# EasyEDA Pro project RCkid.epro, schematic Cartridge
Board Name: Cartridge; Create Date: 2025-02-21; Page Name: Cartridge 1; Project Name: rckid3_devboard; Schematic Name: Cartridge; Update Date: 2025-02-21; Company: EasyEDA.com; Drawn: EasyEDA; Page Size: A4; Part Number: JLCPCB-002; Reviewed: EasyEDA; Version: V0.1
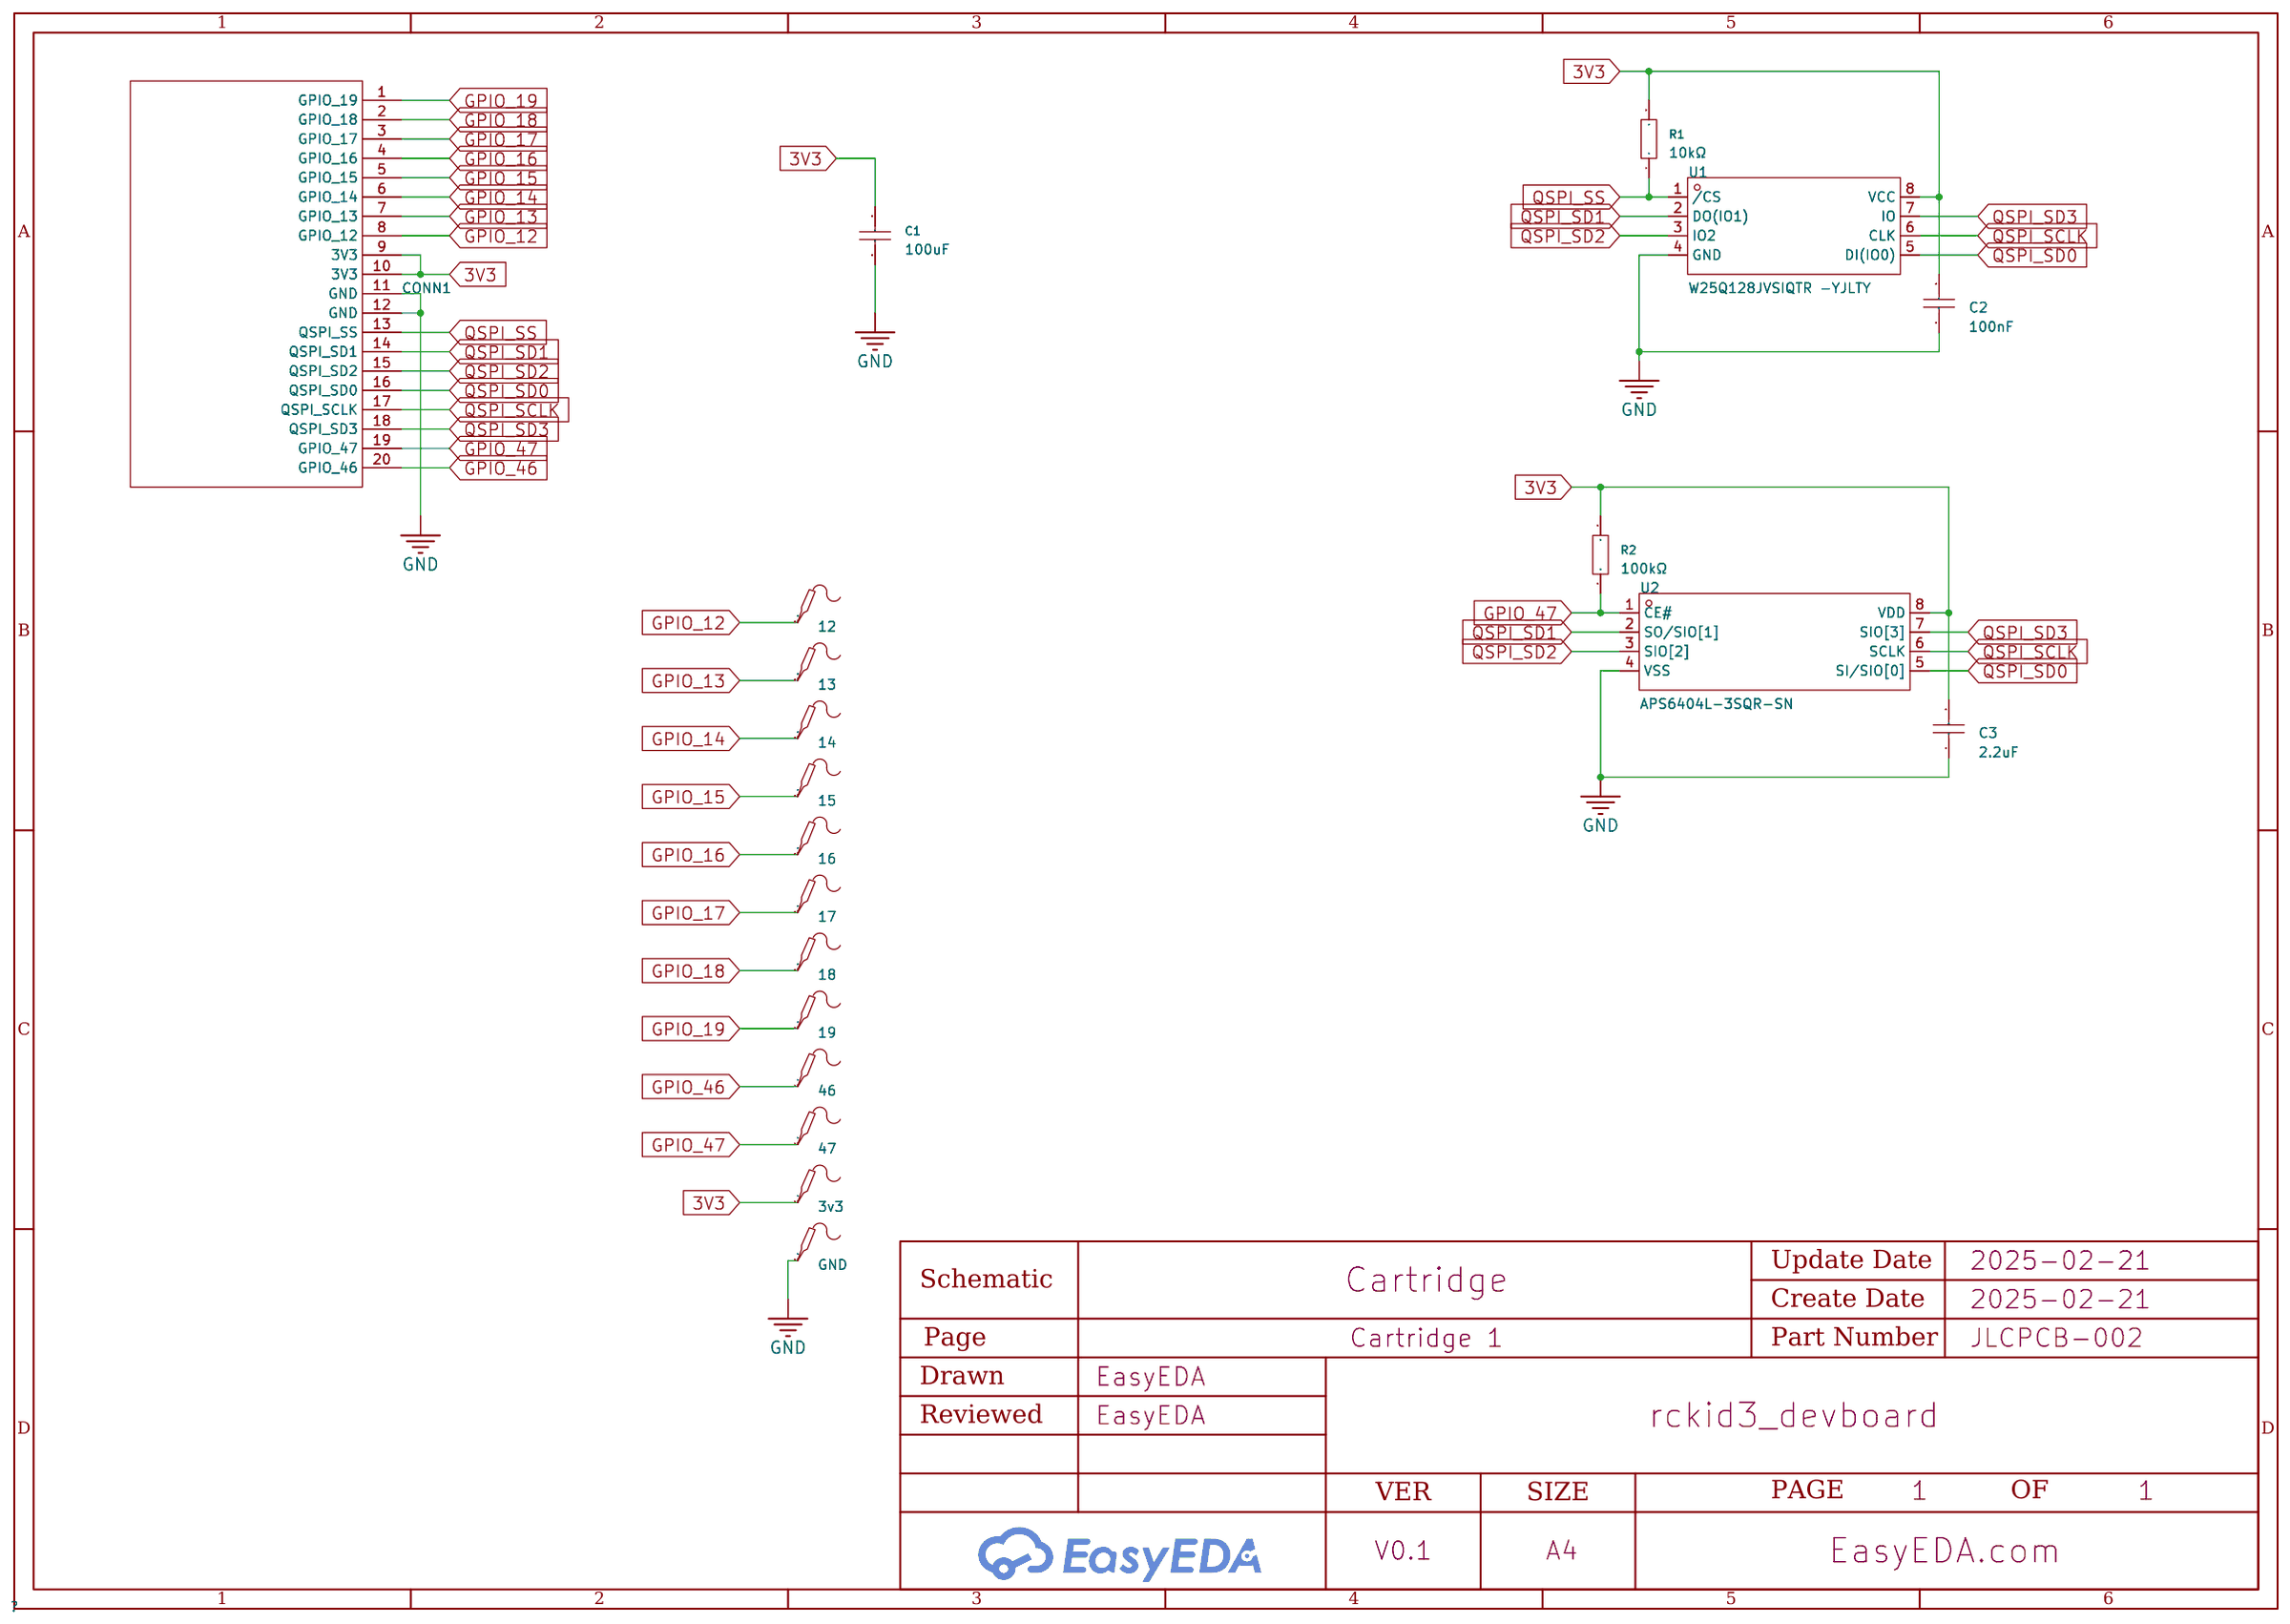
[diagram p6: schematic sheet]

## Parts
3v3  -  [TEST-SMD_BD1.9-L4.2]
12  -  [TEST-SMD_BD1.9-L4.2]
13  -  [TEST-SMD_BD1.9-L4.2]
14  -  [TEST-SMD_BD1.9-L4.2]
15  -  [TEST-SMD_BD1.9-L4.2]
16  -  [TEST-SMD_BD1.9-L4.2]
17  -  [TEST-SMD_BD1.9-L4.2]
18  -  [TEST-SMD_BD1.9-L4.2]
19  -  [TEST-SMD_BD1.9-L4.2]
46  -  [TEST-SMD_BD1.9-L4.2]
47  -  [TEST-SMD_BD1.9-L4.2]
C1  100uF  [C1206]
C2  100nF  [C0805]
C3  2.2uF  [C0805]
CONN1  -  [RCKid Cartridge Pins]
GND  -  [TEST-SMD_BD1.9-L4.2]
R1  10kΩ  [R0805]
R2  100kΩ  [R0805]
U1  W25Q128JVSIQTR -YJLTY  [SOIC-8_L5.3-W5.3-P1.27-LS8.0-BL]
U2  APS6404L-3SQR-SN  [SOIC-8_L4.9-W3.9-P1.27-LS6.0-BL]

## Library data of the parts
3v3 12-19 46 47 GND = Test-Point: Test Point 测试点
C1 = CL31A107MQHNNNE: Capacitance: Tolerance:±20% Tolerance:±20% Voltage Rated: Temperature Coefficient:; LCSC Part Name: 100uF±20%6.3V; Supplier Part: C15008; Manufacturer: SAMSUNG(三星); Supplier Footprint: 1206; JLCPCB Part Class: BasicPart; Datasheet: https://atta.szlcsc.com/upload/public/pdf/source/20160103/1457707673200.pdf; Supplier: LCSC; Tolerance: ±20%
C2 = CL21B104KCFNNNE: Capacitance: Tolerance:±10% Tolerance:±10% Voltage Rated: Temperature Coefficient:; LCSC Part Name: 100nF ±10% 100V; Supplier Part: C28233; Manufacturer: SAMSUNG(三星); Supplier Footprint: 0805; JLCPCB Part Class: Basic Part; Datasheet: https://atta.szlcsc.com/upload/public/pdf/source/20160103/1457707716102.pdf; Supplier: LCSC; Tolerance: ±10%
C3 = 0805F225M500NT: Capacitance:2.2uF Tolerance:±20% Tolerance:±20% Voltage Rated: Temperature Coefficient:; LCSC Part Name: 2.2uF ±20% 50V; Supplier Part: C49217; Manufacturer: FH(风华); Supplier Footprint: 0805; JLCPCB Part Class: Extended Part; Datasheet: https://atta.szlcsc.com/upload/public/pdf/source/20200305/C486355_26A10D38EF8C2A5C37091D0039909270.pdf; Supplier: LCSC; Tolerance: ±20%
CONN1 = RCKid2 Cartridge Connector
R1 = 0805W8F1002T5E: Resistance:10000Ω Tolerance:±1% Tolerance:±1% Power(Watts): Overload Voltage (Max): Temperature Coefficient:±100ppm/℃ Temperature Coefficient:±100ppm/℃ Type:Thick Film Resistors Operating Temperature Range:-55℃~+155℃ Operating Temperature Range:-55℃~+155℃; LCSC Part Name: 10kΩ ±1% 125mW 厚膜电阻; Supplier Part: C17414; Manufacturer: UNI-ROYAL(厚声); Supplier Footprint: 0805; JLCPCB Part Class: Basic Part; Datasheet: https://atta.szlcsc.com/upload/public/pdf/source/20200306/C422600_1E6D84923E4A46A82E41ADD87F860B5C.pdf; Supplier: LCSC; Tolerance: ±1%; Temperature Coefficient: ±100ppm/℃; Type: Thick Film Resistors; Operating Temperature Range: -55℃~+155℃
R2 = 0805W8F1003T5E: Type:Thick Film Resistors Resistance:100kΩ Tolerance:±1% Tolerance:±1% Power(Watts): Overload Voltage (Max): Temperature Coefficient:±100ppm/℃ Temperature Coefficient:±100ppm/℃ Operating Temperature Range:-55℃~+155℃ Operating Temperature Range:-55℃~+155℃; LCSC Part Name: 100kΩ ±1% 125mW 厚膜电阻; Supplier Part: C149504; Manufacturer: UNI-ROYAL(厚声); Supplier Footprint: 0805; JLCPCB Part Class: Basic Part; Datasheet: https://atta.szlcsc.com/upload/public/pdf/source/20200306/C422600_1E6D84923E4A46A82E41ADD87F860B5C.pdf; Supplier: LCSC; Type: Thick Film Resistors; Tolerance: ±1%; Temperature Coefficient: ±100ppm/℃; Operating Temperature Range: -55℃~+155℃
U1 = W25Q128JVSIQTR -YJLTY: LCSC Part Name: 串行闪存; Supplier Part: C2921483; Manufacturer: WINBOND(华邦); Supplier Footprint: SOIC-8-208mil; JLCPCB Part Class: Extended Part; Datasheet: 2021-11-15/642689F/b4c28fe9be624f43904f2fc1db378149/STM32F429IGT6.pdf; Supplier: LCSC
U2 = APS6404L-3SQR-SN_C5333729: Supplier Part: C5333729; Manufacturer: Apmemory; Supplier Footprint: SOP-8; JLCPCB Part Class: Extended Part; Datasheet: https://atta.szlcsc.com/upload/public/pdf/source/20230206/47F6F63A2B63C528FEFCE249E0943D90.pdf; Supplier: LCSC

## Nets
3V3: 3v3.1 C1.2 C2.2 C3.2 CONN1.9(3V3) CONN1.10(3V3) R1.2 R2.2 U1.8(VCC) U2.8(VDD)
GND: C1.1 C2.1 C3.1 CONN1.11(GND) CONN1.12(GND) GND.1 U1.4(GND) U2.4(VSS)
GPIO_12: 12.1 CONN1.8(GPIO_12)
GPIO_13: 13.1 CONN1.7(GPIO_13)
GPIO_14: 14.1 CONN1.6(GPIO_14)
GPIO_15: 15.1 CONN1.5(GPIO_15)
GPIO_16: 16.1 CONN1.4(GPIO_16)
GPIO_17: 17.1 CONN1.3(GPIO_17)
GPIO_18: 18.1 CONN1.2(GPIO_18)
GPIO_19: 19.1 CONN1.1(GPIO_19)
GPIO_46: 46.1 CONN1.20(GPIO_46)
GPIO_47: 47.1 CONN1.19(GPIO_47) R2.1 U2.1(CE#)
QSPI_SCLK: CONN1.17(QSPI_SCLK) U1.6(CLK) U2.6(SCLK)
QSPI_SD0: CONN1.16(QSPI_SD0) U1.5(DI(IO0)) U2.5(SI/SIO[0])
QSPI_SD1: CONN1.14(QSPI_SD1) U1.2(DO(IO1)) U2.2(SO/SIO[1])
QSPI_SD2: CONN1.15(QSPI_SD2) U1.3(IO2) U2.3(SIO[2])
QSPI_SD3: CONN1.18(QSPI_SD3) U1.7(IO) U2.7(SIO[3])
QSPI_SS: CONN1.13(QSPI_SS) R1.1 U1.1(/CS)
